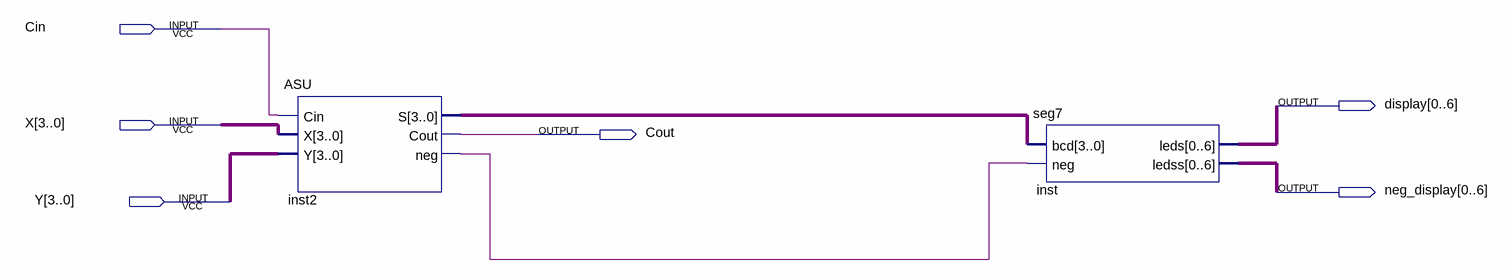
[diagram p0: schematic sheet]
// Quartus schematic circuit.bdf as structural Verilog: 2 symbols, 6 pins
module circuit (
  input  Cin,
  input  [3:0] X,
  input  [3:0] Y,
  output [0:6] display,
  output Cout,
  output [0:6] neg_display
);

  wire inst2_neg;
  wire [3:0] inst2_s;

  ASU inst2 (.Cin(Cin), .X(X), .Y(Y), .S(inst2_s), .Cout(Cout), .neg(inst2_neg));
  seg7 inst (.bcd(inst2_s), .neg(inst2_neg), .leds(display), .ledss(neg_display));
endmodule
